# EAGLE schematic RemoteSensor_LPC1549 (EAGLE 7.3.0)
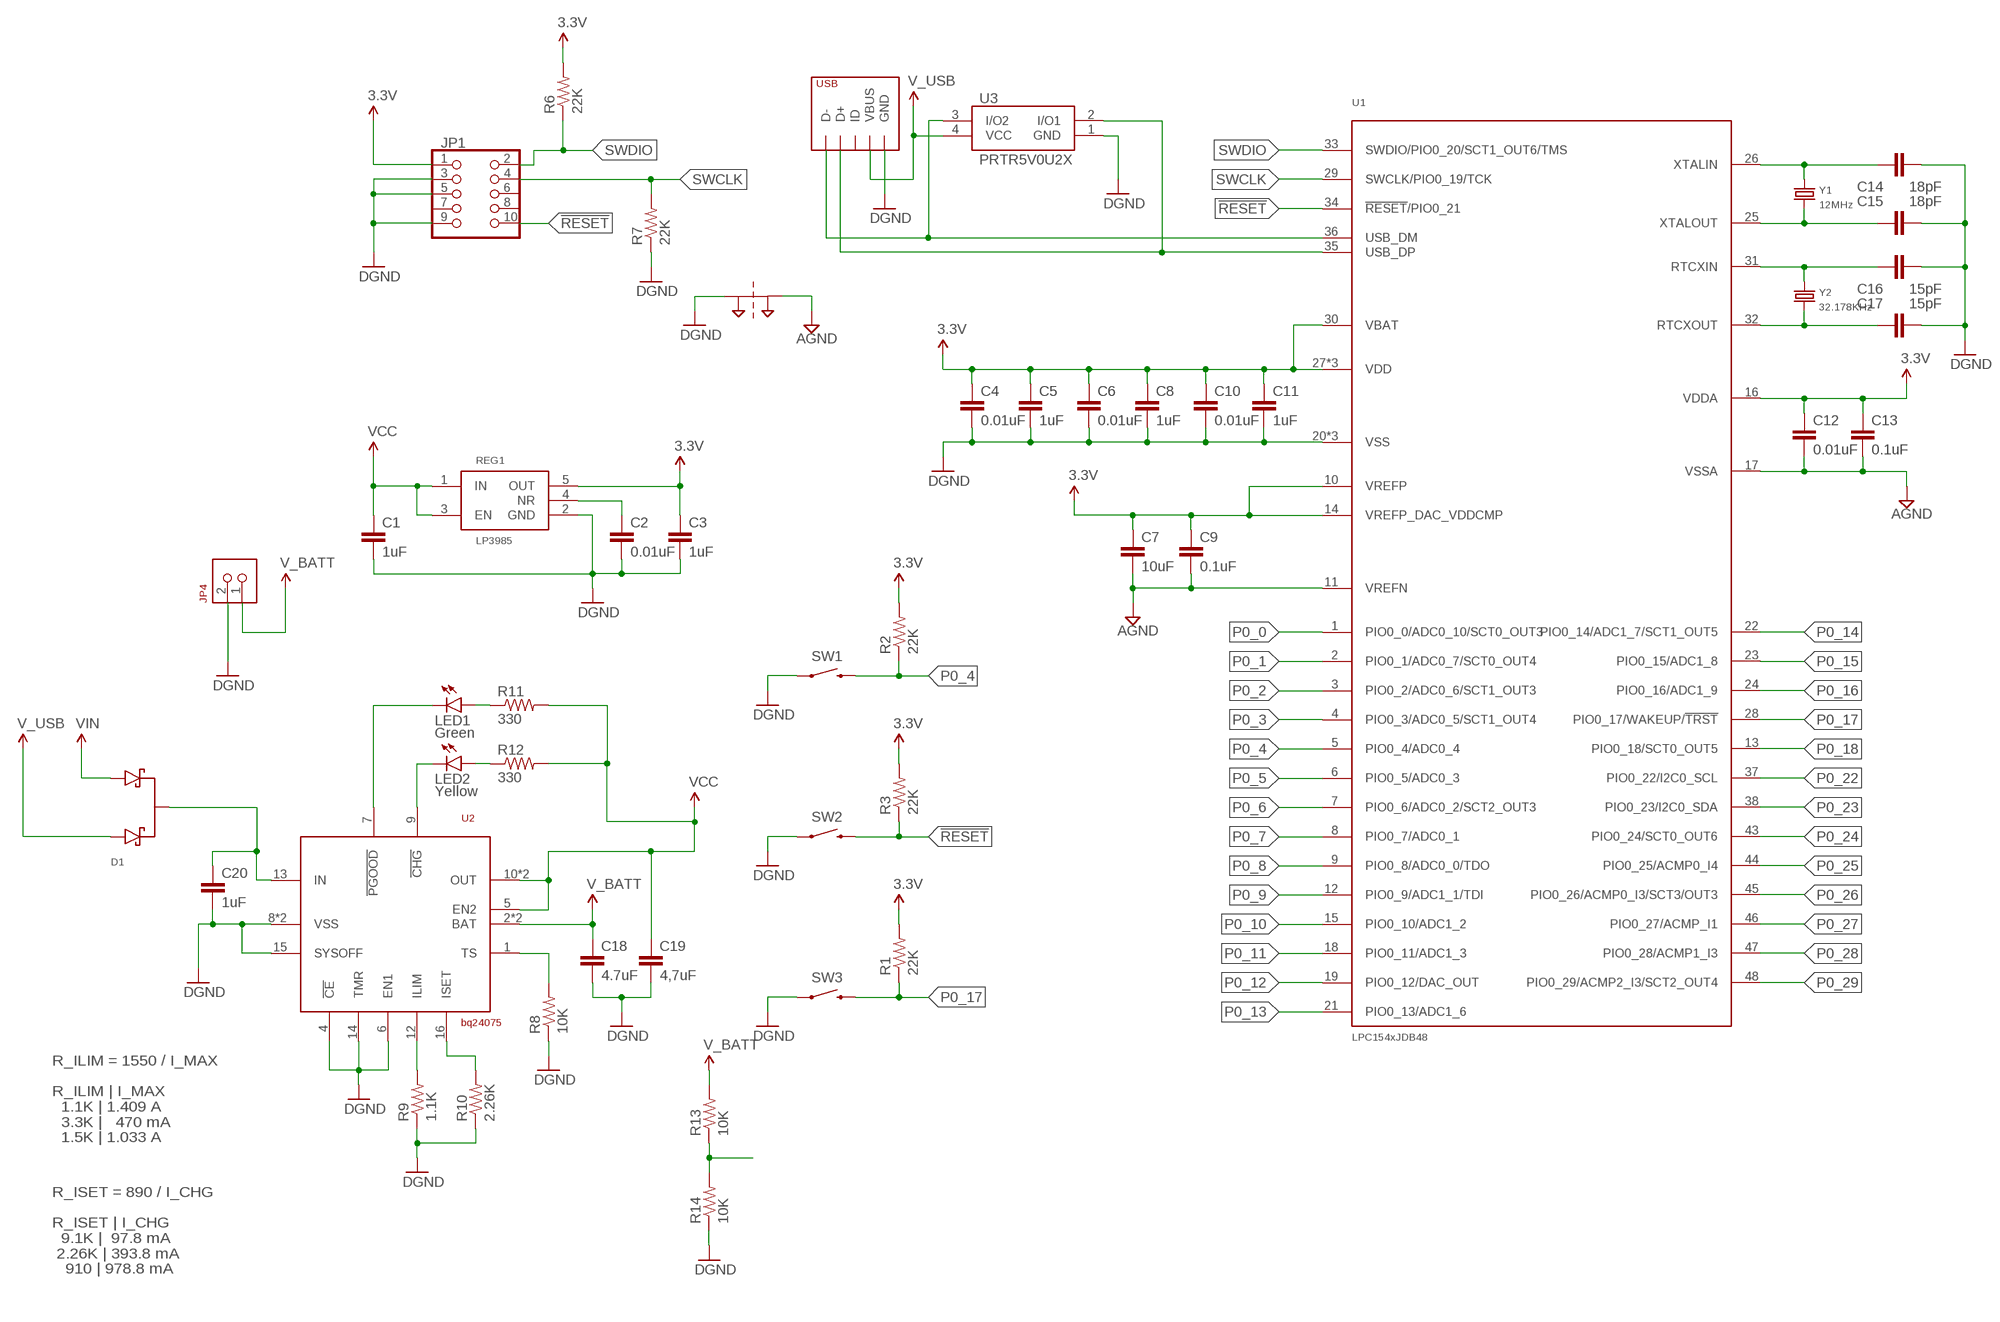
[diagram p0: schematic, sheet 1, part 1 of 2]
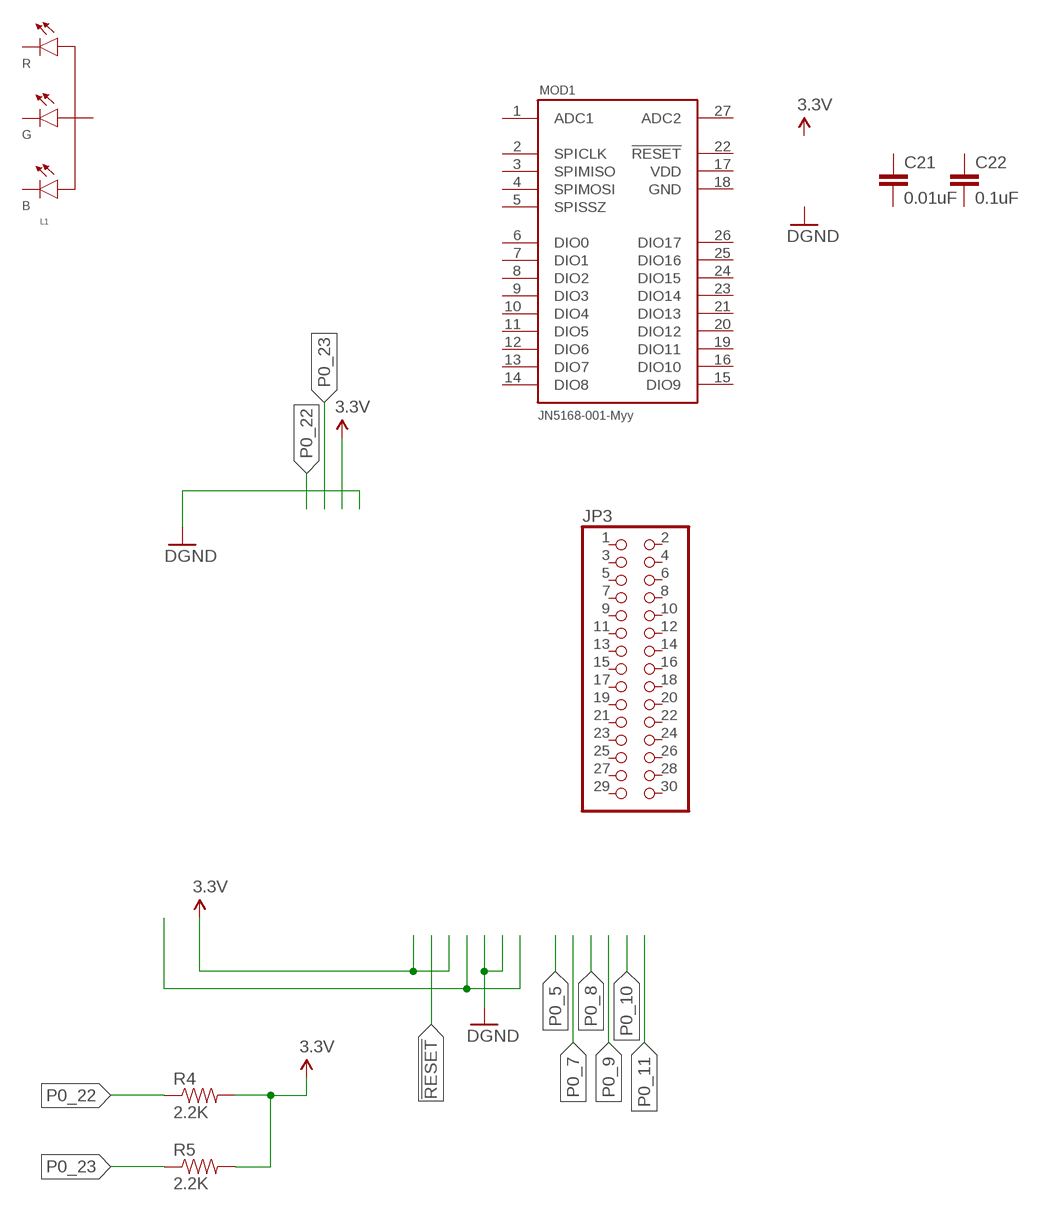
[diagram p1: schematic, sheet 1, part 2 of 2]

## Parts
C1  1uF  C0603  [C0603]
C2  0.01uF  C0603  [C0603]
C3  1uF  C0603  [C0603]
C4  0.01uF  C0603  [C0603]
C5  1uF  C0603  [C0603]
C6  0.01uF  C0603  [C0603]
C7  10uF  C0603  [C0603]
C8  1uF  C0603  [C0603]
C9  0.1uF  C0603  [C0603]
C10  0.01uF  C0603  [C0603]
C11  1uF  C0603  [C0603]
C12  0.01uF  C0603  [C0603]
C13  0.1uF  C0603  [C0603]
C14  18pF  C0603  [C0603]
C15  18pF  C0603  [C0603]
C16  15pF  C0603  [C0603]
C17  15pF  C0603  [C0603]
C18  4.7uF  C0805  [C0805]
C19  4,7uF  C0805  [C0805]
C20  1uF  C0603  [C0603]
C21  0.01uF  C0603  [C0603]
C22  0.1uF  C0603  [C0603]
D1  DIODE_SCHOTTKY_DUAL_CMN_CATHODE_SOT1061  [SOT1061]
JP1  HEADER_2X5MALE_PTH  [HEADER_50MIL_2X5_PTH]
JP2  USB_RECEPTICLE_MICRO-B  [USB_MICO_B]
JP3  PINHD-2X15  [2X15]
JP4  HEADER_1X2JST-PH_HEADER_HORIZONTAL  [JST-PH-2-THM-RA]
L1  LED_RGB_CA-CLVBA-FKA  [P-LCC4-0]
LED1  Green  LED0603  [LED-0603]
LED2  Yellow  LED0603  [LED-0603]
MOD1  JN5168-001-M00  [JN5168-001-M00]
PT1  2PT_GND_TIE  [2PT_GND_TIE]
R1  22K  R0603  [R0603]
R2  22K  R0603  [R0603]
R3  22K  R0603  [R0603]
R4  2.2K  R0603  [R0603]
R5  2.2K  R0603  [R0603]
R6  22K  R0603  [R0603]
R7  22K  R0603  [R0603]
R8  10K  R0603  [R0603]
R9  1.1K  R0603  [R0603]
R10  2.26K  R0603  [R0603]
R11  330  R0603  [R0603]
R12  330  R0603  [R0603]
R13  10K  R0603  [R0603]
R14  10K  R0603  [R0603]
REG1  LP3985DBV  [SOT23]
SW1  KMR221GLFS  [TACTILE_SWITCH_SMD-3]
SW2  KMR221GLFS  [TACTILE_SWITCH_SMD-3]
SW3  KMR221GLFS  [TACTILE_SWITCH_SMD-3]
U1  LPC154XJDB48  [TQFP48_7X7]
U2  BQ24075  [QFN16]
U3  PRTR5V0U2X  [SOT143]
Y1  12MHz  CRYSTAL_3.2X2.5_4PAD  [CRYSTAL_SMD_3.2X2.5_4PAD]
Y2  32.178KHz  CRYSTAL_3.2X1.5_2PAD  [CRYSTAL_3.2X1.5_2PAD]

## Nets
3.3V: C3.1 C4.1 C5.1 C6.1 C7.1 C8.1 C9.1 C10.1 C11.1 C12.1 C13.1 JP1.1 R1.2 R2.2 R3.2 R4.2 R5.2 R6.2 REG1.5(OUT) U1.10(VREFP) U1.14(VREFP_DAC_VDDCMP) U1.16(VDDA) U1.27(VDD) U1.30(VBAT) U1.39(VDD) U1.42(VDD)
!RESET!: JP1.10 R3.1 SW2.3 SW2.4 U1.34(!RESET!/PIO0_21)
AGND: C7.2 C9.2 C12.2 C13.2 PT1.P$2 U1.11(VREFN) U1.17(VSSA)
GND: C1.2 C2.2 C3.2 C4.2 C5.2 C6.2 C8.2 C10.2 C11.2 C14.2 C15.2 C16.2 C17.2 C18.2 C19.2 C20.2 JP1.3 JP1.5 JP1.9 JP2.GND JP2.MOUNT$1(GND) JP2.MOUNT$2(GND) JP4.2 PT1.P$1 R7.1 R8.1 R9.1 R10.1 R14.1 REG1.2(GND) SW1.1 SW1.2 SW2.1 SW2.2 SW3.1 SW3.2 U1.20(VSS) U1.40(VSS) U1.41(VSS) U2.4(!CE) U2.6(EN1) U2.8(VSS) U2.14(TMR) U2.15(SYSOFF) U2.TH(VSS) U3.1(GND) ; supply symbol labelled DGND
N$1: JP2.D+ U1.35(USB_DP) U3.2(I/O1)
N$2: JP2.D- U1.36(USB_DM) U3.3(I/O2)
N$3: C14.1 U1.26(XTALIN) Y1.1
N$4: C15.1 U1.25(XTALOUT) Y1.3
N$5: C16.1 U1.31(RTCXIN) Y2.P$1
N$6: C17.1 U1.32(RTCXOUT) Y2.P$2
N$7: R9.2 U2.12(ILIM)
N$8: C2.1 REG1.4(NR)
N$9: R8.2 U2.1(TS)
N$10: LED1.A R11.1
N$11: R10.2 U2.16(ISET)
N$13: C20.1 D1.3(K) U2.13(IN)
N$14: LED2.A R12.1
N$15: LED1.C U2.7(!PGOOD)
N$16: LED2.C U2.9(!CHG)
P0_0: U1.1(PIO0_0/ADC0_10/SCT0_OUT3)
P0_1: U1.2(PIO0_1/ADC0_7/SCT0_OUT4)
P0_2: U1.3(PIO0_2/ADC0_6/SCT1_OUT3)
P0_3: U1.4(PIO0_3/ADC0_5/SCT1_OUT4)
P0_4: R2.1 SW1.3 SW1.4 U1.5(PIO0_4/ADC0_4)
P0_5: R13.1 R14.2 U1.6(PIO0_5/ADC0_3)
P0_6: U1.7(PIO0_6/ADC0_2/SCT2_OUT3)
P0_7: U1.8(PIO0_7/ADC0_1)
P0_8: U1.9(PIO0_8/ADC0_0/TDO)
P0_9: U1.12(PIO0_9/ADC1_1/TDI)
P0_10: U1.15(PIO0_10/ADC1_2)
P0_11: U1.18(PIO0_11/ADC1_3)
P0_12: U1.19(PIO0_12/DAC_OUT)
P0_13: U1.21(PIO0_13/ADC1_6)
P0_14: U1.22(PIO0_14/ADC1_7/SCT1_OUT5)
P0_15: U1.23(PIO0_15/ADC1_8)
P0_16: U1.24(PIO0_16/ADC1_9)
P0_17: R1.1 SW3.3 SW3.4 U1.28(PIO0_17/WAKEUP/!TRST!)
P0_18: U1.13(PIO0_18/SCT0_OUT5)
P0_22: R4.1 U1.37(PIO0_22/I2C0_SCL)
P0_23: R5.1 U1.38(PIO0_23/I2C0_SDA)
P0_24: U1.43(PIO0_24/SCT0_OUT6)
P0_25: U1.44(PIO0_25/ACMP0_I4)
P0_26: U1.45(PIO0_26/ACMP0_I3/SCT3/OUT3)
P0_27: U1.46(PIO0_27/ACMP_I1)
P0_28: U1.47(PIO0_28/ACMP1_I3)
P0_29: U1.48(PIO0_29/ACMP2_I3/SCT2_OUT4)
SWCLK: JP1.4 R7.2 U1.29(SWCLK/PIO0_19/TCK)
SWDIO: JP1.2 R6.1 U1.33(SWDIO/PIO0_20/SCT1_OUT6/TMS)
V_BATT: C18.1 JP4.1 R13.2 U2.2(BAT) U2.3(BAT)
V_USB: D1.2(A2) JP2.VBUS U3.4(VCC)
VCC: C1.1 C19.1 R11.2 R12.2 REG1.1(IN) REG1.3(EN) U2.5(EN2) U2.10(OUT) U2.11(OUT)
VIN: D1.1(A1)
Unconnected: C21.1 C21.2 C22.1 C22.2 JP1.6 JP1.7 JP1.8 JP2.ID JP3.1 JP3.2 JP3.3 JP3.4 JP3.5 JP3.6 JP3.7 JP3.8 JP3.9 JP3.10 JP3.11 JP3.12 JP3.13 JP3.14 JP3.15 JP3.16 JP3.17 JP3.18 JP3.19 JP3.20 JP3.21 JP3.22 JP3.23 JP3.24 JP3.25 JP3.26 JP3.27 JP3.28 JP3.29 JP3.30 L1.1(RK) L1.2(A) L1.3(BK) L1.4(GK) MOD1.1(ADC1) MOD1.2(SPICLK) MOD1.3(SPIMISO) MOD1.4(SPIMOSI) MOD1.5(SPISSZ) MOD1.6(DIO0) MOD1.7(DIO1) MOD1.8(DIO2) MOD1.9(DIO3) MOD1.10(DIO4) MOD1.11(DIO5) MOD1.12(DIO6) MOD1.13(DIO7) MOD1.14(DIO8) MOD1.15(DIO9) MOD1.16(DIO10) MOD1.19(DIO11) MOD1.20(DIO12) MOD1.21(DIO13) MOD1.22(!RESET) MOD1.23(DIO14) MOD1.24(DIO15) MOD1.25(DIO16) MOD1.26(DIO17) MOD1.27(ADC2)

## Notes on the sheet
- R_ILIM = 1550 / I_MAX
  
  R_ILIM | I_MAX
    1.1K | 1.409 A
    3.3K |   470 mA
    1.5K | 1.033 A
- R_ISET = 890 / I_CHG
  
  R_ISET | I_CHG
    9.1K |  97.8 mA
   2.26K | 393.8 mA
     910 | 978.8 mA

## Power pins joined to a net without a drawn wire
GND: MOD1.18(GND)
VDD: MOD1.17(VDD)

## Library data of the parts
C1-C22 = heck:C
D1 = heck:DIODE_SCHOTTKY_DUAL_CMN_CATHODE
JP1 = heck:HEADER_2X5: PIN HEADER
JP2 = heck:USB_RECEPTICLE: Wurth Electronics Inc 629105136821
JP3 = pinhead:PINHD-2X15: PIN HEADER
JP4 = heck:HEADER_1X2
L1 = heck:LED_RGB_CA: Cree: CLVBA-FKA
LED1 LED2 = SparkFun-LED:LED: LEDs Standard schematic elements and footprints for 5mm, 3mm, 1206, and 0603 sized LEDs. 5mm - Spark Fun Electronics SKU : COM-00529 (and others)
MOD1 = heck:JN5168-001-M: The JN5168-001-Myy family is a range of ultra low power, high performance surface mount modules targeted at IEEE 802.15.4, JenNet-IP, ZigBee Light Link, ZigBee Smart Energy and RF4CE networking applications, enabling users to realise products with minimum time to market and at the lowest cost. They remove the need for expensive and lengthy development of custom RF board designs and test suites. The modules use NXP’s JN5168 wireless microcontroller to provide a comprehensive solution with large memory, high CPU and radio performance and all RF components included. All that is required to develop and manufacture wireless control or sensing products is to connect a power supply and peripherals such as switches, actuators and sensors, considerably simplifying product development. Four module variants are available: JN5168-001-M00 with an integrated antenna, JN5168-001-M03 with an antenna connector and the JN5168-001-M05 and M06 with an antenna connector, power amplifier and LNA for extended range. The JN5168-001-M05 output power has been optimised for use in Europe and Asia.
PT1 = SparkFun-Passives:2PT_GND_TIE: Package for connecting two ground nets in one place.
R1-R14 = heck:R
REG1 = heck:LP3985: Ultra Low-Dropout CMOS Voltage regulator. 150mA Load, available in fixed voltages: 2.5-V, 2.6-V, 2.7-V, 2.8-V, 2.85-V, 2.9-V, 3-V, 3.1V, 3.2-V, 3.3-V, 4.7-V, 4.75-V, 4.8-V and 5-V
SW1-SW3 = heck:KMR221
U1 = heck:LPC154XJDB48
U2 = heck:BQ24075
U3 = heck:PRTR5V0U2X
Y1 Y2 = heck:CRYSTAL